# Altium schematic sheet mother1-pic2.SchDoc
size A4
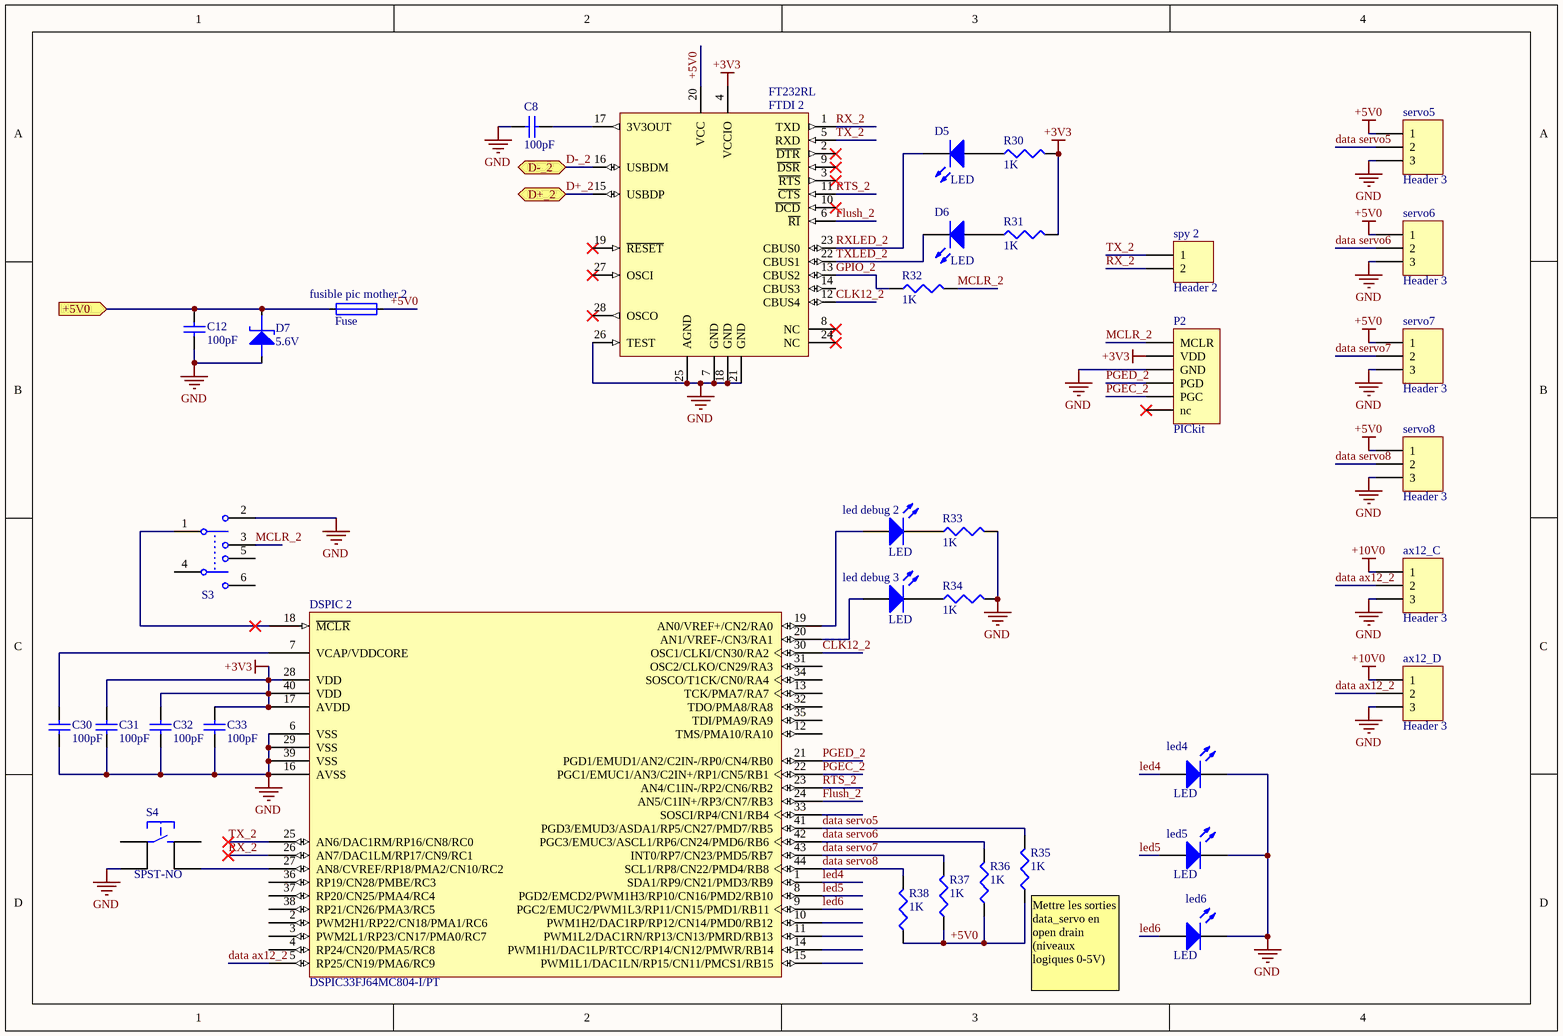
[diagram p0: mother1-pic2.SchDoc]

## Parts
ax12_C  Header 3  [HDR1X3]
ax12_D  Header 3  [HDR1X3]
C8  value 100pF  [C0805C]  (hidden comment: CAP)
C12  value 100pF  [C0805C]  (hidden comment: CAP)
C30  value 100pF  [C0805C]  (hidden comment: CAP)
C31  value 100pF  [C0805C]  (hidden comment: CAP)
C32  value 100pF  [C0805C]  (hidden comment: CAP)
C33  value 100pF  [C0805C]  (hidden comment: CAP)
D5  LED  [LED1206Y]
D6  LED  [LED1206Y]
D7  5.6V  [DSO-C2/X1.8]
DSPIC_2  DSPIC33FJ64MC804-I/PT  [TQFP-PT44_N]
FTDI_2  FT232RL  [SSOP-28_M]
fusible_pic_mother_2  Fuse  [Fuse Holder 5x20mm]
led4  LED  [LED1206G]
led5  LED  [LED1206G]
led6  LED  [LED1206G]
led_debug_2  LED  [LED1206R]
led_debug_3  LED  [LED1206R]
P2  PICkit  [HDR1X6H]
R30  value 1K  [C0805R]  (hidden comment: RES)
R31  value 1K  [C0805R]  (hidden comment: RES)
R32  value 1K  [C0805R]  (hidden comment: RES)
R33  value 1K  [C0805R]  (hidden comment: RES)
R34  value 1K  [C0805R]  (hidden comment: RES)
R35  value 1K  [C0805R]  (hidden comment: RES)
R36  value 1K  [C0805R]  (hidden comment: RES)
R37  value 1K  [C0805R]  (hidden comment: RES)
R38  value 1K  [C0805R]  (hidden comment: RES)
S3  SW-DPDT/Reset  [MCLSS22]  (value not drawn)
S4  SPST-NO  [SPST-NO]
servo5  Header 3  [HDR1X3]
servo6  Header 3  [HDR1X3]
servo7  Header 3  [HDR1X3]
servo8  Header 3  [HDR1X3]
spy_2  Header 2  [HDR1X2]

## Ports
+5V0 (in), D+_2 (bidir), D-_2 (bidir)

## Nets
+3V3: C31.2 C32.2 C33.2 DSPIC_2.17(AVDD) DSPIC_2.28(VDD) DSPIC_2.40(VDD) FTDI_2.4(VCCIO) P2.2(VDD) R30.2 R31.2
+5V0: FTDI_2.20(VCC) fusible_pic_mother_2.2 R35.1 R36.1 R37.1 R38.1 servo5.1 servo6.1 servo7.1 servo8.1
+10V0: ax12_C.1 ax12_D.1
GND: ax12_C.3 ax12_D.3 C8.2 C12.1 C30.1 C31.1 C32.1 C33.1 D7.1(A) DSPIC_2.6(VSS) DSPIC_2.16(AVSS) DSPIC_2.29(VSS) DSPIC_2.39(VSS) FTDI_2.7(GND) FTDI_2.18(GND) FTDI_2.21(GND) FTDI_2.25(AGND) FTDI_2.26(TEST) led4.2(K) led5.2(K) led6.2(K) P2.3(GND) R33.2 R34.2 S3.2 S4.2 servo5.3 servo6.3 servo7.3 servo8.3
+5V0: C12.2 D7.2(K) fusible_pic_mother_2.1 ; port +5V0  [a separate net that carries the same name]
CLK12_2: DSPIC_2.30(OSC1/CLKI/CN30/RA2) FTDI_2.12(CBUS4)
D+_2: FTDI_2.15(USBDP) ; port D+_2
D-_2: FTDI_2.16(USBDM) ; port D-_2
data ax12_2: ax12_C.2 ax12_D.2 DSPIC_2.5(RP25/CN19/PMA6/RC9)
data servo5: DSPIC_2.41(PGD3/EMUD3/ASDA1/RP5/CN27/PMD7/RB5) R35.2 servo5.2
data servo6: DSPIC_2.42(PGC3/EMUC3/ASCL1/RP6/CN24/PMD6/RB6) R36.2 servo6.2
data servo7: DSPIC_2.43(INT0/RP7/CN23/PMD5/RB7) R37.2 servo7.2
data servo8: DSPIC_2.44(SCL1/RP8/CN22/PMD4/RB8) R38.2 servo8.2
Flush_2: DSPIC_2.24(AN5/C1IN+/RP3/CN7/RB3) FTDI_2.6(~{RI})
GPIO_2: FTDI_2.13(CBUS2) R32.1
led4: DSPIC_2.1(SDA1/RP9/CN21/PMD3/RB9) led4.1(A)
led5: DSPIC_2.8(PGD2/EMCD2/PWM1H3/RP10/CN16/PMD2/RB10) led5.1(A)
led6: DSPIC_2.9(PGC2/EMUC2/PWM1L3/RP11/CN15/PMD1/RB11) led6.1(A)
MCLR_2: P2.1(MCLR) R32.2 S3.3
PGEC_2: DSPIC_2.22(PGC1/EMUC1/AN3/C2IN+/RP1/CN5/RB1) P2.5(PGC)
PGED_2: DSPIC_2.21(PGD1/EMUD1/AN2/C2IN-/RP0/CN4/RB0) P2.4(PGD)
RTS_2: DSPIC_2.23(AN4/C1IN-/RP2/CN6/RB2) FTDI_2.11(~{CTS})
RX_2: DSPIC_2.26(AN7/DAC1LM/RP17/CN9/RC1) FTDI_2.1(TXD) spy_2.2
RXLED_2: D5.2(K) FTDI_2.23(CBUS0)
TX_2: DSPIC_2.25(AN6/DAC1RM/RP16/CN8/RC0) FTDI_2.5(RXD) spy_2.1
TXLED_2: D6.2(K) FTDI_2.22(CBUS1)
NetC8_1: C8.1 FTDI_2.17(3V3OUT)
NetC30_2: C30.2 DSPIC_2.7(VCAP/VDDCORE)
NetD5_1: D5.1(A) R30.1
NetD6_1: D6.1(A) R31.1
NetDSPIC_2_18: DSPIC_2.18(~{MCLR}) S3.1
NetDSPIC_2_19: DSPIC_2.19(AN0/VREF+/CN2/RA0) led_debug_2.1(A)
NetDSPIC_2_20: DSPIC_2.20(AN1/VREF-/CN3/RA1) led_debug_3.1(A)
NetDSPIC_2_27: DSPIC_2.27(AN8/CVREF/RP18/PMA2/CN10/RC2) S4.3
Netled_debug_2_2: led_debug_2.2(K) R33.1
Netled_debug_3_2: led_debug_3.2(K) R34.1

Not connected (* = marked no-connect by the designer): DSPIC_2 2(PWM2H1/RP22/CN18/PMA1/RC6) 3(PWM2L1/RP23/CN17/PMA0/RC7) 4(RP24/CN20/PMA5/RC8) 10(PWM1H2/DAC1RP/RP12/CN14/PMD0/RB12) 11(PWM1L2/DAC1RN/RP13/CN13/PMRD/RB13) 12(TMS/PMA10/RA10) 13(TCK/PMA7/RA7) 14(PWM1H1/DAC1LP/RTCC/RP14/CN12/PMWR/RB14) 15(PWM1L1/DAC1LN/RP15/CN11/PMCS1/RB15) 31(OSC2/CLKO/CN29/RA3) 32(TDO/PMA8/RA8) 33(SOSCI/RP4/CN1/RB4) 34(SOSCO/T1CK/CN0/RA4) 35(TDI/PMA9/RA9) 36(RP19/CN28/PMBE/RC3) 37(RP20/CN25/PMA4/RC4) 38(RP21/CN26/PMA3/RC5); FTDI_2 2(~{DTR})* 3(~{RTS})* 8(NC)* 9(~{DSR})* 10(~{DCD})* 14(CBUS3) 19(~{RESET})* 24(NC)* 27(OSCI)* 28(OSCO)*; P2 6(nc)*; S3 4 5 6; S4 1 4

## Notes on the sheet
- (near R35) Mettre les sorties data_servo en open drain (niveaux logiques 0-5V)

## Library data of the parts
ax12_C ax12_D servo5-servo8 = Header 3: Header, 3-Pin; LatestRevisionDate: 17-Jul-2002; LatestRevisionNote: Re-released for DXP Platform.; Publisher: Altium Limited
C8 C12 C30-C33 = CAP: Capacitor; Published: 8-Jun-2000; LatestRevisionDate: 29-May-2009; LatestRevisionNote: IPC-7351 Footprint Added.; PackageReference: C1206; Publisher: Altium Limited; PackageDescription: Chip Capacitor
D5 D6 led_debug_2 led_debug_3 = LED2: Typical RED, GREEN, YELLOW, AMBER GaAs LED; Published: 8-Jun-2000; LatestRevisionDate: 17-Jul-2002; LatestRevisionNote: Re-released for DXP Platform.; PackageVersion: Feb-2002; PackageReference: 3.2X1.6X1.1; Publisher: Altium Limited; PackageDescription: SM LED; 2 Flat Leads
D7 = ZENER: Zener Diode
DSPIC_2 = DSPIC33FJ64MC804-I/PT: High-Performance 16-bit Digital Signal Controller, 64 KB Flash, 16 KB RAM, 44-Pin TQFP, Industrial Temperature; Published: 2-Dec-2009; DatasheetVersion: revD, Nov-2009; PackageVersion: revBB, Aug-2009; PackageReference: TQFP-PT44; Publisher: Altium Limited; PackageDescription: 44-Lead Plastic Thin Quad Flatpack (PT) - 10x10x1mm Body, 2.00mm [TQFP]; Supplier 1: Digi-Key; Supplier Part Number 1: DSPIC33FJ64MC804-I/PT-ND; Supplier 2: Farnell; Supplier Part Number 2: 1576844; Code_JEDEC: MS-026; ComponentLink1Description: Datasheet; ComponentLink1URL: http://ww1.microchip.com/downloads/en/DeviceDoc/70291D.pdf; ComponentLink2Description: Packaging Specification; ComponentLink2URL: http://www.microchip.com/stellent/groups/techpub_sg/documents/packagingspec/en012702.pdf; ComponentLink3Description: Microchip.com Home; ComponentLink3URL: http://www.microchip.com/
FTDI_2 = FT232RL: USB UART Asynchronous Serial Data Transfer Chip, SSOP-28, Tube; Published: 19-Aug-2010; DatasheetVersion: ver 2.07, Jul-2010; PackageVersion: 2010; PackageReference: SSOP-28; Publisher: Altium Limited; PackageDescription: 28-Pin Small Outline Package 0.65 mm Pitch; ComponentLink1Description: Manufacturer Link; ComponentLink1URL: http://www.ftdichip.com/Products/ICs/FT232R.htm; ComponentLink2Description: Datasheet; ComponentLink2URL: http://www.ftdichip.com/Support/Documents/DataSheets/ICs/DS_FT232R.pdf
led4-led6 = LED: Typical RED, GREEN, YELLOW, AMBER GaAs LED; Published: 8-Jun-2000; LatestRevisionDate: 17-Jul-2002; LatestRevisionNote: Re-released for DXP Platform.; PackageVersion: Feb-2002; PackageReference: 3.2X1.6X1.1; Publisher: Altium Limited; PackageDescription: SM LED; 2 Flat Leads
P2 = Header ICSP: Header, 6-Pin, Right Angle; LatestRevisionDate: 17-Jul-2002; LatestRevisionNote: Re-released for DXP Platform.; Publisher: Altium Limited
R30-R38 = RES: Resistor; Published: 8-Jun-2000; LatestRevisionDate: 29-May-2009; LatestRevisionNote: IPC-7351 Footprint Added.; PackageReference: J1-0603; Publisher: Altium Limited; PackageDescription: Chip Resistor
S3 = SW-DPDT: Double-Pole, Double-Throw Switch, ref MCLSS22; Published: 24-Mar-1999; LatestRevisionDate: 17-Jul-2002; LatestRevisionNote: Re-released for DXP Platform.; PackageReference: DPDT-6; Publisher: Altium Limited; PackageDescription: Switch; 6 Leads
S4 = SPST-NO: Tactile Switch 7.3mm, SMD
spy_2 = Header 2: Header, 2-Pin; LatestRevisionDate: 17-Jul-2002; LatestRevisionNote: Re-released for DXP Platform.; Publisher: Altium Limited